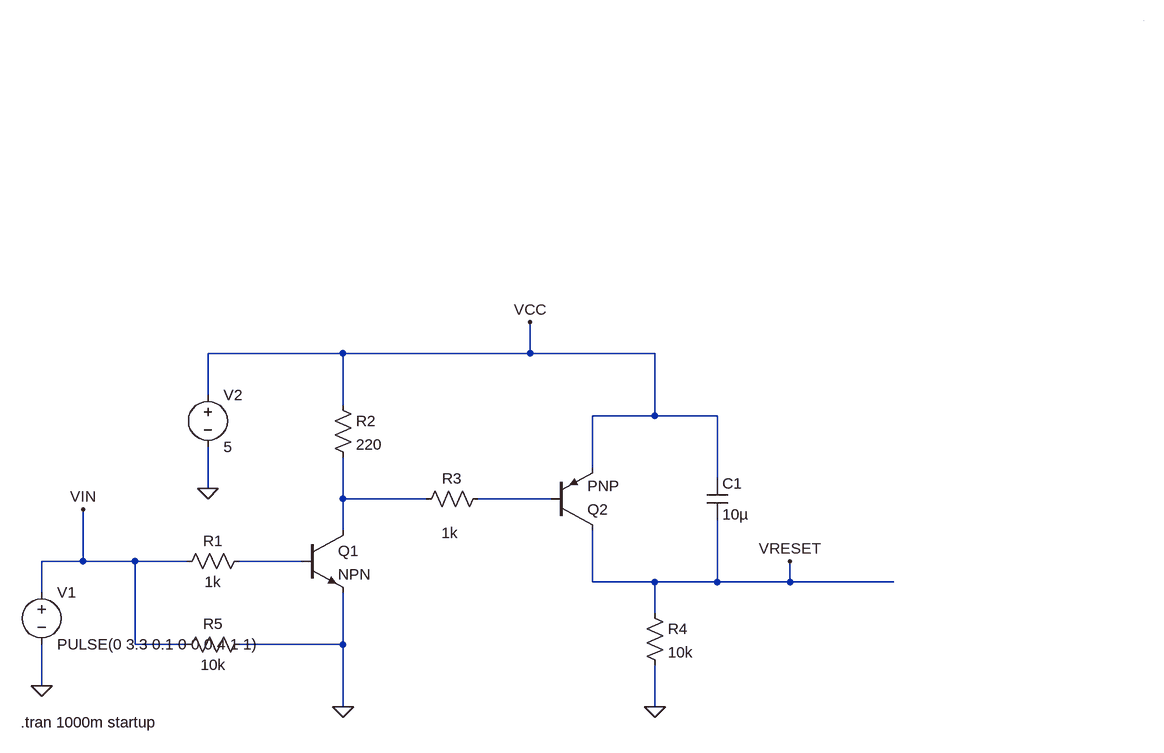
[diagram p0: schematic asp_rpi_reset_at89s52.asc]
asp_rpi_reset_at89s52.asc, the LTspice schematic file:
Version 4
SHEET 1 880 1096
WIRE -1232 512 -1440 512
WIRE -944 512 -944 464
WIRE -944 512 -1232 512
WIRE -752 512 -944 512
WIRE -1440 576 -1440 512
WIRE -1232 592 -1232 512
WIRE -752 608 -752 512
WIRE -752 608 -848 608
WIRE -656 608 -752 608
WIRE -848 688 -848 608
WIRE -656 704 -656 608
WIRE -1440 720 -1440 656
WIRE -1232 736 -1232 672
WIRE -1104 736 -1232 736
WIRE -912 736 -1024 736
WIRE -1232 784 -1232 736
WIRE -1632 832 -1632 752
WIRE -1632 832 -1696 832
WIRE -1552 832 -1632 832
WIRE -1472 832 -1552 832
WIRE -1296 832 -1392 832
WIRE -848 864 -848 784
WIRE -752 864 -848 864
WIRE -656 864 -656 768
WIRE -656 864 -752 864
WIRE -544 864 -544 832
WIRE -544 864 -656 864
WIRE -384 864 -544 864
WIRE -1696 880 -1696 832
WIRE -752 912 -752 864
WIRE -1552 960 -1552 832
WIRE -1472 960 -1552 960
WIRE -1232 960 -1232 880
WIRE -1232 960 -1392 960
WIRE -1696 1024 -1696 960
WIRE -1232 1056 -1232 960
WIRE -752 1056 -752 992
WIRE 0 0 0 0
FLAG -1232 1056 0
FLAG -752 1056 0
FLAG -1696 1024 0
FLAG -1440 720 0
FLAG -544 832 VRESET
FLAG -944 464 VCC
FLAG -1632 752 VIN
SYMBOL npn -1296 784 R0
SYMATTR InstName Q1
SYMBOL res -1376 816 R90
WINDOW 0 0 56 VBottom 2
WINDOW 3 32 56 VTop 2
SYMATTR InstName R1
SYMATTR Value 1k
SYMBOL res -1248 576 R0
SYMATTR InstName R2
SYMATTR Value 220
SYMBOL res -1008 720 R90
WINDOW 0 0 56 VBottom 2
WINDOW 3 53 60 VTop 2
SYMATTR InstName R3
SYMATTR Value 1k
SYMBOL pnp -912 784 M180
SYMATTR InstName Q2
SYMBOL cap -672 704 R0
SYMATTR InstName C1
SYMATTR Value 10µ
SYMBOL res -768 896 R0
SYMATTR InstName R4
SYMATTR Value 10k
SYMBOL voltage -1696 864 R0
WINDOW 123 0 0 Left 2
WINDOW 39 0 0 Left 2
SYMATTR InstName V1
SYMATTR Value PULSE(0 3.3 0.1 0 0 0.4 1 1)
SYMBOL res -1376 944 R90
WINDOW 0 0 56 VBottom 2
WINDOW 3 32 56 VTop 2
SYMATTR InstName R5
SYMATTR Value 10k
SYMBOL voltage -1440 560 R0
WINDOW 123 0 0 Left 2
WINDOW 39 0 0 Left 2
SYMATTR InstName V2
SYMATTR Value 5
TEXT -1728 1080 Left 2 !.tran 1000m startup

The netlist it stands for:
* asp_rpi_reset_at89s52.asc
Q1 N001 N003 0 0 NPN
R1 N003 VIN 1k
R2 VCC N001 220
R3 N002 N001 1k
Q2 VRESET N002 VCC 0 PNP
C1 VCC VRESET 10µ
R4 VRESET 0 10k
V1 VIN 0 PULSE(0 3.3 0.1 0 0 0.4 1 1)
R5 0 VIN 10k
V2 VCC 0 5
.model NPN NPN
.model PNP PNP
.lib standard.bjt
.tran 1000m startup
.backanno
.end